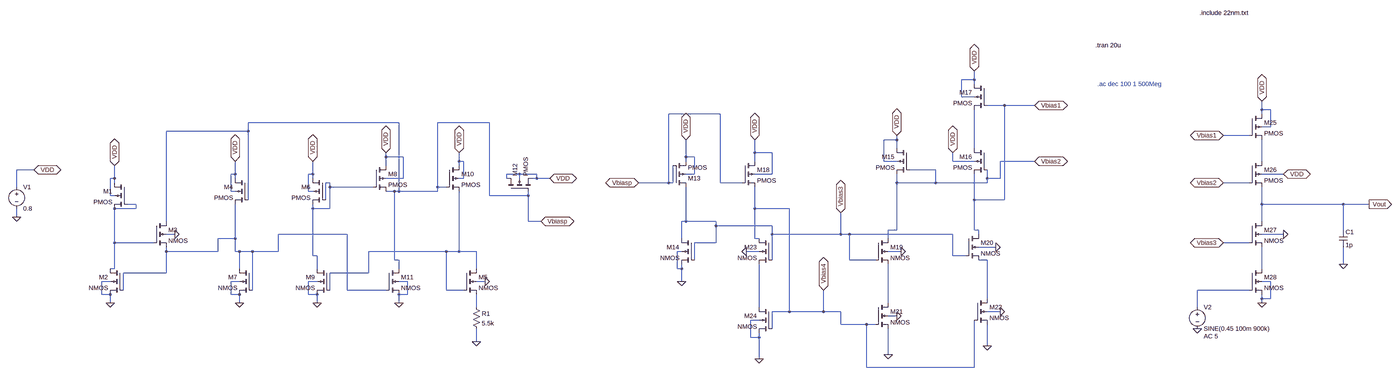
[diagram p0: schematic 22nm.asc, whole sheet]
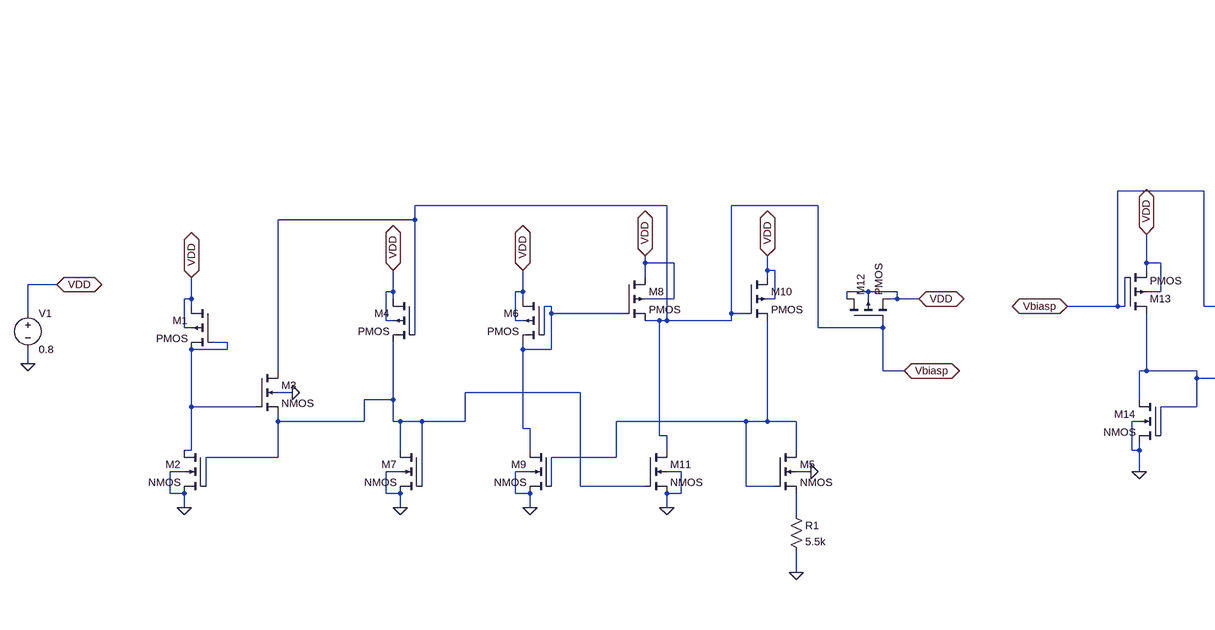
[diagram p1: schematic 22nm.asc, part, row 1 of 1, column 1 of 2]
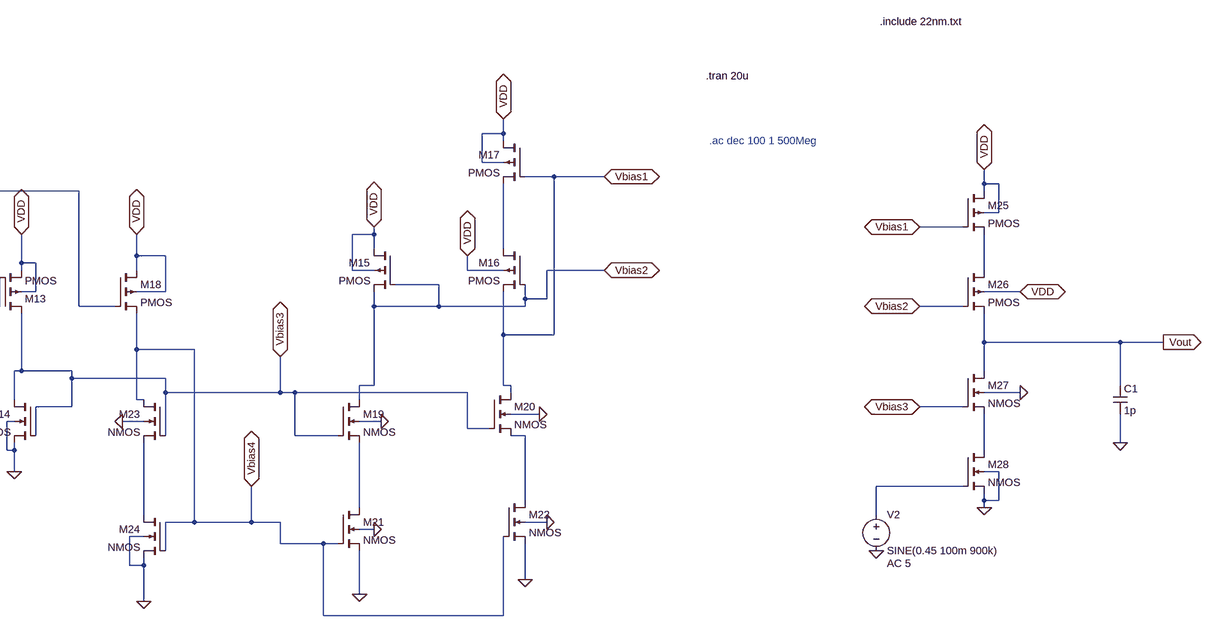
[diagram p2: schematic 22nm.asc, part, row 1 of 1, column 2 of 2]
22nm.asc, the LTspice schematic file:
Version 4
SHEET 1 5464 936
WIRE 3104 -288 3104 -320
WIRE 3104 -288 3056 -288
WIRE 3104 -272 3104 -288
WIRE 3056 -224 3056 -288
WIRE 3104 -224 3056 -224
WIRE 3216 -192 3152 -192
WIRE 3328 -192 3216 -192
WIRE 4384 -176 4384 -208
WIRE 4416 -176 4384 -176
WIRE 2144 -160 1952 -160
WIRE 4384 -160 4384 -176
WIRE 800 -128 240 -128
WIRE 1136 -128 944 -128
WIRE 4416 -112 4416 -176
WIRE 4416 -112 4384 -112
WIRE 240 -96 240 -128
WIRE 240 -96 -64 -96
WIRE 4336 -80 4240 -80
WIRE 2816 -64 2816 -80
WIRE 2816 -64 2768 -64
WIRE 2816 -32 2816 -64
WIRE 3104 -32 3104 -176
WIRE 2272 -16 2272 -64
WIRE 2336 -16 2272 -16
WIRE 752 0 752 -16
WIRE 816 0 752 0
WIRE 2016 0 2016 -64
WIRE 2048 0 2016 0
WIRE 1024 16 1024 -16
WIRE 1040 16 1024 16
WIRE 2016 16 2016 0
WIRE 2272 16 2272 -16
WIRE 2768 16 2768 -64
WIRE 2816 16 2768 16
WIRE 3024 16 3024 -16
WIRE 3104 16 3024 16
WIRE 3328 16 3200 16
WIRE 4384 16 4384 -64
WIRE 752 32 752 0
WIRE 1024 32 1024 16
WIRE -784 48 -848 48
WIRE 2960 48 2864 48
WIRE 192 64 192 16
WIRE 192 64 176 64
WIRE 480 64 480 16
WIRE 480 64 464 64
WIRE 1248 64 1200 64
WIRE 1312 64 1248 64
WIRE 2048 64 2048 0
WIRE 2048 64 2016 64
WIRE 2336 64 2336 -16
WIRE 2336 64 2272 64
WIRE 4464 64 4384 64
WIRE -256 80 -256 32
WIRE -256 80 -272 80
WIRE 192 80 192 64
WIRE 480 80 480 64
WIRE 816 80 816 0
WIRE 816 80 752 80
WIRE 1040 80 1040 16
WIRE 1040 80 1024 80
WIRE 1200 80 1200 64
WIRE 1248 80 1248 64
WIRE 1312 80 1312 64
WIRE 1312 80 1296 80
WIRE 1360 80 1312 80
WIRE 3152 80 3152 48
WIRE 3200 80 3200 16
WIRE 3200 80 3152 80
WIRE -256 96 -256 80
WIRE 544 96 528 96
WIRE 1952 96 1952 -160
WIRE 1952 96 1840 96
WIRE 1968 96 1968 32
WIRE 1968 96 1952 96
WIRE 2144 96 2144 -160
WIRE 2224 96 2144 96
WIRE 2816 96 2816 64
WIRE 2960 96 2960 48
WIRE 2960 96 2816 96
WIRE 3152 96 3152 80
WIRE 3152 96 2960 96
WIRE 4336 96 4240 96
WIRE -848 112 -848 48
WIRE 544 112 544 96
WIRE 704 112 544 112
WIRE 944 112 944 -128
WIRE 976 112 944 112
WIRE 176 128 176 64
WIRE 192 128 176 128
WIRE 464 128 464 64
WIRE 480 128 464 128
WIRE 784 128 752 128
WIRE 800 128 800 -128
WIRE 800 128 784 128
WIRE 944 128 944 112
WIRE 944 128 800 128
WIRE -272 144 -272 80
WIRE -256 144 -272 144
WIRE 1136 144 1136 -128
WIRE 1280 144 1280 128
WIRE 1280 144 1136 144
WIRE 240 160 240 -96
WIRE 528 160 528 96
WIRE 3104 160 3104 64
WIRE 3216 160 3216 -192
WIRE 3216 160 3104 160
WIRE -176 176 -208 176
WIRE 4384 176 4384 112
WIRE 4688 176 4384 176
WIRE 4784 176 4688 176
WIRE -176 192 -176 176
WIRE -176 192 -256 192
WIRE 480 192 480 176
WIRE 544 192 544 112
WIRE 544 192 480 192
WIRE 2272 192 2272 112
WIRE 2400 192 2272 192
WIRE -848 224 -848 192
WIRE -64 240 -64 -96
WIRE 1280 240 1280 144
WIRE 1328 240 1280 240
WIRE 2016 240 2016 112
WIRE 2016 240 2000 240
WIRE 2128 240 2016 240
WIRE 4384 240 4384 176
WIRE 2128 256 2128 240
WIRE 2336 256 2128 256
WIRE 2816 272 2816 96
WIRE 2816 272 2784 272
WIRE 3104 272 3104 160
WIRE 3120 272 3104 272
WIRE 4688 272 4688 176
WIRE -32 288 -64 288
WIRE 608 288 352 288
WIRE 2336 288 2336 256
WIRE 2608 288 2608 208
WIRE 2608 288 2336 288
WIRE 2640 288 2608 288
WIRE 3024 288 2640 288
WIRE 3120 288 3120 272
WIRE 4464 288 4384 288
WIRE 192 304 192 176
WIRE 192 304 128 304
WIRE 2000 304 2000 240
WIRE 2272 304 2272 192
WIRE 2288 304 2272 304
WIRE 2784 304 2784 272
WIRE -256 320 -256 192
WIRE -112 320 -256 320
WIRE 2128 320 2128 256
WIRE 2128 320 2048 320
WIRE 4336 320 4240 320
WIRE 3184 336 3120 336
WIRE -64 352 -64 336
WIRE 128 352 128 304
WIRE 128 352 -64 352
WIRE 192 352 192 304
WIRE 208 352 192 352
WIRE 256 352 208 352
WIRE 352 352 352 288
WIRE 352 352 256 352
WIRE 976 352 688 352
WIRE 1024 352 1024 128
WIRE 1024 352 976 352
WIRE 1088 352 1024 352
WIRE 2000 352 1984 352
WIRE 2288 352 2240 352
WIRE 2832 352 2784 352
WIRE 480 368 480 192
WIRE 496 368 480 368
WIRE 3024 368 3024 288
WIRE 3072 368 3024 368
WIRE 784 384 784 128
WIRE 800 384 784 384
WIRE 2048 384 2048 320
WIRE 2336 384 2336 288
WIRE 2640 384 2640 288
WIRE 2736 384 2640 384
WIRE 3152 384 3120 384
WIRE 4688 400 4688 336
WIRE -256 416 -256 320
WIRE -256 416 -272 416
WIRE 208 416 208 352
WIRE 496 416 496 368
WIRE 800 416 800 384
WIRE 1088 416 1088 352
WIRE 1984 416 1984 352
WIRE 2000 416 2000 400
WIRE 2000 416 1984 416
WIRE 4384 416 4384 336
WIRE -64 432 -64 352
WIRE -64 432 -224 432
WIRE 688 432 688 352
WIRE 688 432 544 432
WIRE -272 464 -304 464
WIRE 208 464 176 464
WIRE 496 464 464 464
WIRE 832 464 800 464
WIRE 1120 464 1088 464
WIRE 2000 464 2000 416
WIRE 4416 464 4384 464
WIRE -224 496 -224 432
WIRE 256 496 256 352
WIRE 544 496 544 432
WIRE 608 496 608 288
WIRE 752 496 608 496
WIRE 976 496 976 352
WIRE 1040 496 976 496
WIRE 4336 496 4144 496
WIRE -304 512 -304 464
WIRE -272 512 -304 512
WIRE 176 512 176 464
WIRE 208 512 176 512
WIRE 464 512 464 464
WIRE 496 512 464 512
WIRE 832 512 832 464
WIRE 832 512 800 512
WIRE 3152 528 3152 384
WIRE 4384 528 4384 512
WIRE 4416 528 4416 464
WIRE 4416 528 4384 528
WIRE -272 544 -272 512
WIRE 208 544 208 512
WIRE 496 544 496 512
WIRE 800 544 800 512
WIRE 2784 544 2784 400
WIRE 4384 544 4384 528
WIRE 1088 560 1088 512
WIRE 2288 560 2288 400
WIRE 4144 560 4144 496
WIRE 2400 576 2400 192
WIRE 2400 576 2336 576
WIRE 2544 576 2544 496
WIRE 2544 576 2400 576
WIRE 2608 576 2544 576
WIRE 3200 576 3152 576
WIRE 2816 592 2784 592
WIRE 2288 608 2256 608
WIRE 2608 624 2608 576
WIRE 2704 624 2608 624
WIRE 2736 624 2704 624
WIRE 2336 640 2336 576
WIRE 2256 672 2256 608
WIRE 2288 672 2288 656
WIRE 2288 672 2256 672
WIRE 1088 688 1088 640
WIRE 3152 704 3152 624
WIRE 2784 736 2784 640
WIRE 2288 752 2288 672
WIRE 2704 784 2704 624
WIRE 3104 784 3104 608
WIRE 3104 784 2704 784
FLAG -784 48 VDD
IOPIN -784 48 BiDir
FLAG -848 224 0
FLAG -256 32 VDD
IOPIN -256 32 BiDir
FLAG 192 16 VDD
IOPIN 192 16 BiDir
FLAG 480 16 VDD
IOPIN 480 16 BiDir
FLAG 752 -16 VDD
IOPIN 752 -16 BiDir
FLAG 1024 -16 VDD
IOPIN 1024 -16 BiDir
FLAG 1360 80 VDD
IOPIN 1360 80 BiDir
FLAG -272 544 0
FLAG 208 544 0
FLAG 496 544 0
FLAG 800 544 0
FLAG 1088 688 0
FLAG 1328 240 Vbiasp
IOPIN 1328 240 BiDir
FLAG 2016 -64 VDD
IOPIN 2016 -64 BiDir
FLAG 2272 -64 VDD
IOPIN 2272 -64 BiDir
FLAG 2000 464 0
FLAG 2288 752 0
FLAG 2784 736 0
FLAG 3152 704 0
FLAG 1840 96 Vbiasp
IOPIN 1840 96 BiDir
FLAG 3328 -192 Vbias1
IOPIN 3328 -192 BiDir
FLAG 3328 16 Vbias2
IOPIN 3328 16 BiDir
FLAG 2608 208 Vbias3
IOPIN 2608 208 BiDir
FLAG 2544 496 Vbias4
IOPIN 2544 496 BiDir
FLAG -32 288 0
FLAG 2240 352 0
FLAG 2832 352 0
FLAG 3184 336 0
FLAG 1120 464 0
FLAG 3200 576 0
FLAG 2816 592 0
FLAG 4144 640 0
FLAG 4240 -80 Vbias1
IOPIN 4240 -80 BiDir
FLAG 4240 96 Vbias2
IOPIN 4240 96 BiDir
FLAG 4240 320 Vbias3
IOPIN 4240 320 BiDir
FLAG 2816 -80 VDD
IOPIN 2816 -80 BiDir
FLAG 3104 -320 VDD
IOPIN 3104 -320 BiDir
FLAG 3024 -16 VDD
IOPIN 3024 -16 BiDir
FLAG 4384 544 0
FLAG 4688 400 0
FLAG 4784 176 Vout
IOPIN 4784 176 Out
FLAG 4384 -208 VDD
IOPIN 4384 -208 BiDir
FLAG 4464 64 VDD
IOPIN 4464 64 BiDir
FLAG 4464 288 0
SYMBOL pmos4 -208 96 M0
SYMATTR InstName M1
SYMATTR Value2 l=440n w=220n
SYMBOL nmos4 -112 240 R0
SYMATTR InstName M3
SYMATTR Value2 l=44n w=88n
SYMBOL voltage -848 96 R0
WINDOW 123 0 0 Left 0
WINDOW 39 0 0 Left 0
SYMATTR InstName V1
SYMATTR Value 0.8
SYMBOL pmos4 240 80 M0
SYMATTR InstName M4
SYMATTR Value2 l=44n w=528n
SYMBOL pmos4 528 80 M0
SYMATTR InstName M6
SYMATTR Value2 l=44n w=528n
SYMBOL pmos4 704 32 R0
SYMATTR InstName M8
SYMATTR Value2 l=44n w=528n
SYMBOL pmos4 976 32 R0
SYMATTR InstName M10
SYMATTR Value2 l=44n w=528n
SYMBOL pmos4 1200 128 R270
SYMATTR InstName M12
SYMATTR Value2 l=1100n w=1100n
SYMBOL nmos4 -224 416 M0
SYMATTR InstName M2
SYMATTR Value2 l=44n w=220n
SYMBOL nmos4 256 416 M0
SYMATTR InstName M7
SYMATTR Value2 l=44n w=220n
SYMBOL nmos4 544 416 M0
SYMATTR InstName M9
SYMATTR Value2 l=44n w=220n
SYMBOL nmos4 752 416 R0
SYMATTR InstName M11
SYMATTR Value2 l=44n w=220n
SYMBOL nmos4 1040 416 R0
SYMATTR InstName M5
SYMATTR Value2 l=44n w=660n
SYMBOL res 1072 544 R0
SYMATTR InstName R1
SYMATTR Value 5.5k
SYMBOL pmos4 1968 112 M180
SYMATTR InstName M13
SYMATTR Value2 l=22n w=264n
SYMBOL nmos4 2048 304 M0
SYMATTR InstName M14
SYMATTR Value2 l=22n w=55n
SYMBOL pmos4 2224 16 R0
SYMATTR InstName M18
SYMATTR Value2 l=22n w=264n
SYMBOL nmos4 2736 304 R0
SYMATTR InstName M19
SYMATTR Value2 l=22n w=110n
SYMBOL nmos4 3072 288 R0
SYMATTR InstName M20
SYMATTR Value2 l=22n w=110n
SYMBOL nmos4 2736 544 R0
SYMATTR InstName M21
SYMATTR Value2 l=22n w=110n
SYMBOL nmos4 3104 528 R0
SYMATTR InstName M22
SYMATTR Value2 l=22n w=110n
SYMBOL nmos4 2336 304 M0
SYMATTR InstName M23
SYMATTR Value2 l=22n w=110n
SYMBOL nmos4 2336 560 M0
SYMATTR InstName M24
SYMATTR Value2 l=22n w=110n
SYMBOL voltage 4144 544 R0
WINDOW 123 24 124 Left 2
WINDOW 39 0 0 Left 0
SYMATTR Value2 AC 5
SYMATTR InstName V2
SYMATTR Value SINE(0.45 100m 900k)
SYMBOL pmos4 2864 -32 M0
SYMATTR InstName M15
SYMATTR Value2 l=22n w=88n
SYMBOL pmos4 3152 -32 M0
SYMATTR InstName M16
SYMATTR Value2 l=22n w=264n
SYMBOL pmos4 3152 -272 M0
SYMATTR InstName M17
SYMATTR Value2 l=22n w=264n
SYMBOL pmos4 4336 -160 R0
SYMATTR InstName M25
SYMATTR Value2 l=22n w=745.8n
SYMBOL pmos4 4336 16 R0
SYMATTR InstName M26
SYMATTR Value2 l=22n w=745.8n
SYMBOL nmos4 4336 240 R0
SYMATTR InstName M27
SYMATTR Value2 l=22n w=372.9n
SYMBOL nmos4 4336 416 R0
SYMATTR InstName M28
SYMATTR Value2 l=22n w=372.9n
SYMBOL cap 4672 272 R0
SYMATTR InstName C1
SYMATTR Value 1p
TEXT 3640 -416 Left 2 !.tran 20u
TEXT 3648 -272 Left 2 ;.ac dec 100 1 500Meg
TEXT 4152 -584 Left 2 !.include 22nm.txt

The netlist it stands for:
* 22nm.asc
M1 VDD N004 N004 VDD PMOS l=440n w=220n
M3 Vbiasp N004 N005 0 NMOS l=44n w=88n
V1 VDD 0 0.8
M4 VDD Vbiasp N005 VDD PMOS l=44n w=528n
M6 VDD N003 N003 VDD PMOS l=44n w=528n
M8 VDD N003 Vbiasp VDD PMOS l=44n w=528n
M10 VDD Vbiasp N006 VDD PMOS l=44n w=528n
M12 VDD Vbiasp VDD VDD PMOS l=1100n w=1100n
M2 N004 N005 0 0 NMOS l=44n w=220n
M7 N005 N005 0 0 NMOS l=44n w=220n
M9 N003 N006 0 0 NMOS l=44n w=220n
M11 Vbiasp N005 0 0 NMOS l=44n w=220n
M5 N006 N006 N011 0 NMOS l=44n w=660n
R1 N011 0 5.5k
M13 Vbias3 Vbiasp VDD VDD PMOS l=22n w=264n
M14 Vbias3 Vbias3 0 0 NMOS l=22n w=55n
M18 VDD Vbiasp Vbias4 VDD PMOS l=22n w=264n
M19 Vbias2 Vbias3 N010 0 NMOS l=22n w=110n
M20 Vbias1 Vbias3 N007 0 NMOS l=22n w=110n
M21 N010 Vbias4 0 0 NMOS l=22n w=110n
M22 N007 Vbias4 0 0 NMOS l=22n w=110n
M23 Vbias4 Vbias3 N012 0 NMOS l=22n w=110n
M24 N012 Vbias4 0 0 NMOS l=22n w=110n
V2 N009 0 SINE(0.45 100m 900k) AC 5
M15 VDD Vbias2 Vbias2 VDD PMOS l=22n w=88n
M16 N001 Vbias2 Vbias1 VDD PMOS l=22n w=264n
M17 VDD Vbias1 N001 VDD PMOS l=22n w=264n
M25 VDD Vbias1 N002 VDD PMOS l=22n w=745.8n
M26 N002 Vbias2 Vout VDD PMOS l=22n w=745.8n
M27 Vout Vbias3 N008 0 NMOS l=22n w=372.9n
M28 N008 N009 0 0 NMOS l=22n w=372.9n
C1 Vout 0 1p
.model NMOS NMOS
.model PMOS PMOS
.lib standard.mos
.tran 20u
* .ac dec 100 1 500Meg
.include 22nm.txt
.backanno
.end